# EAGLE schematic The Flying Jalapeno v02 (EAGLE 7.6.0)
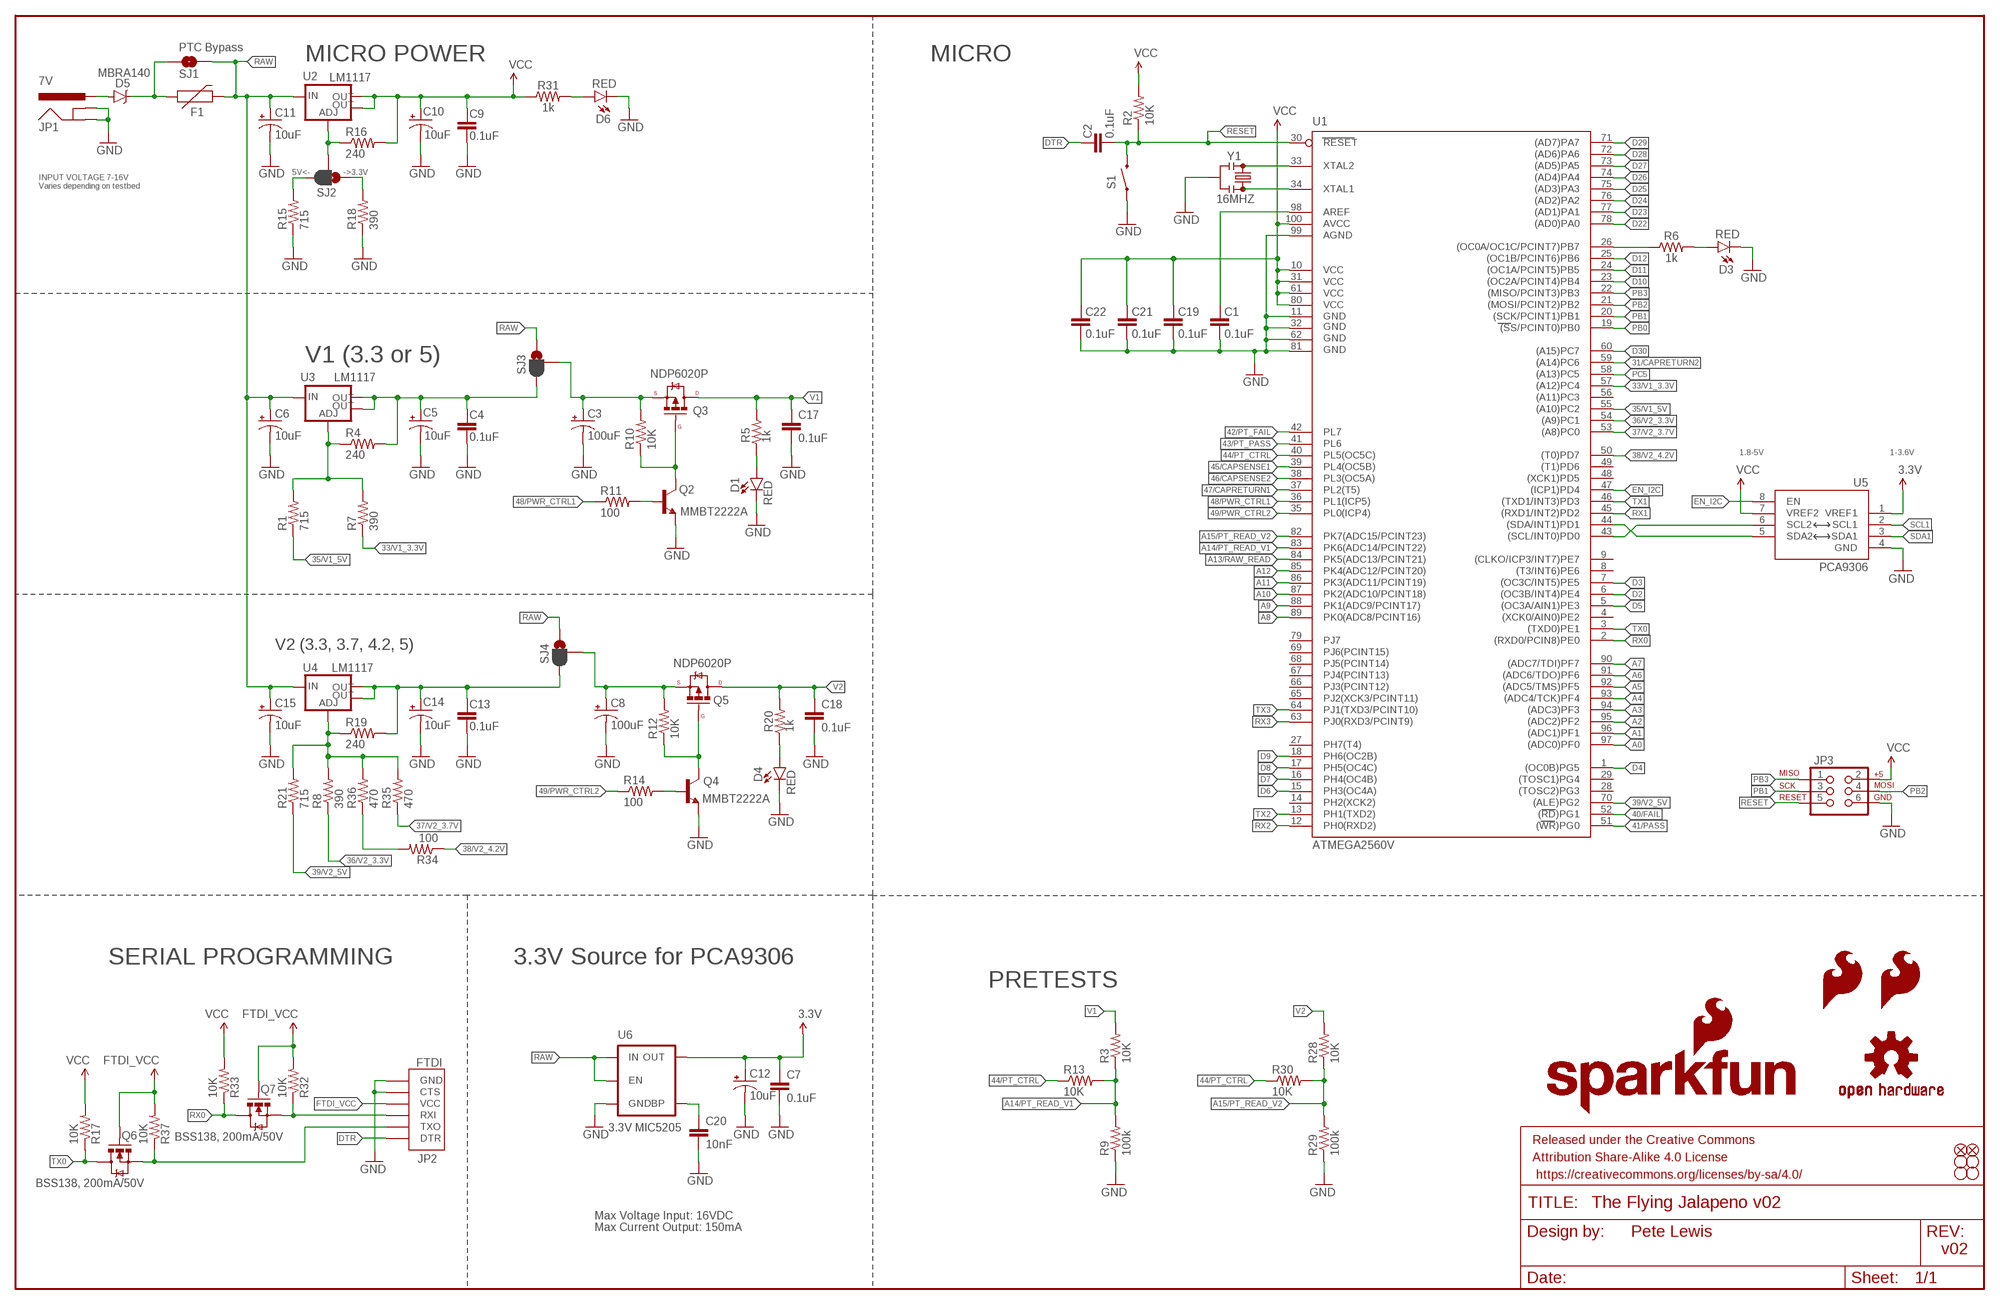
[diagram p0: schematic, sheet 1, part 1 of 2]
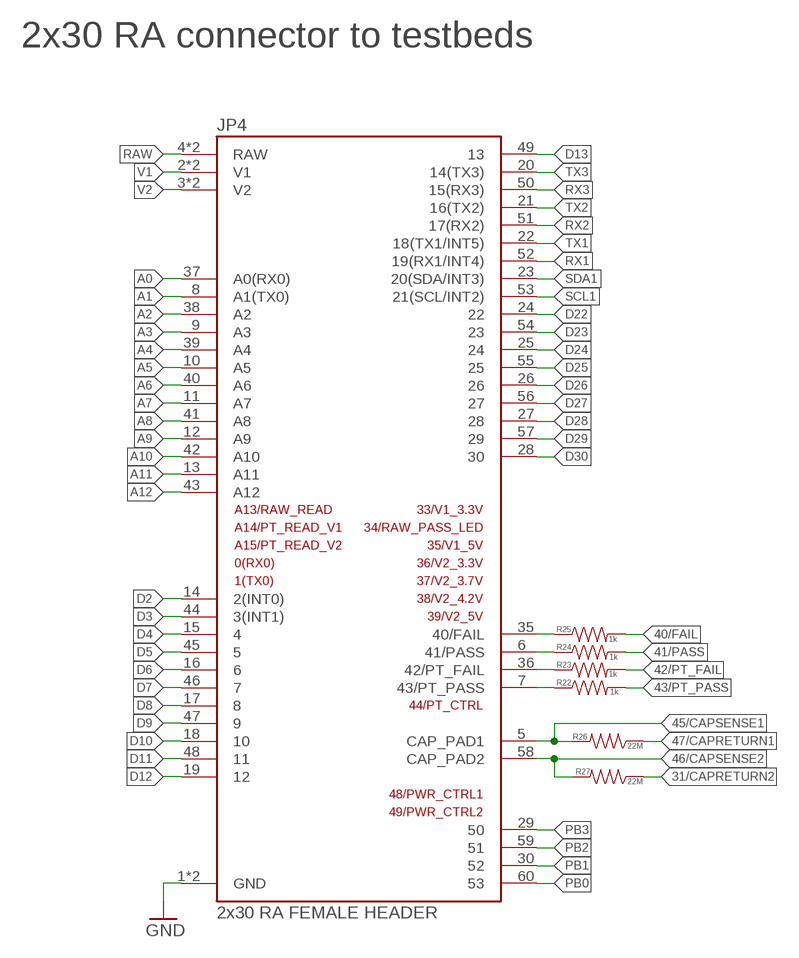
[diagram p1: schematic, sheet 1, part 2 of 2]

## Parts
C1  0.1uF  0.1UF-25V(+80/-20%)(0603)  [0603-CAP]
C2  0.1uF  0.1UF-25V(+80/-20%)(0603)  [0603-CAP]
C3  100uF  100UF-63V-20%(ELECT)  [NIC_10X10.5_CAP]
C4  0.1uF  0.1UF-25V(+80/-20%)(0603)  [0603-CAP]
C5  10uF  10UF-16V-10%(TANT)  [EIA3216]
C6  10uF  10UF-16V-10%(TANT)  [EIA3216]
C7  0.1uF  0.1UF-25V(+80/-20%)(0603)  [0603-CAP]
C8  100uF  100UF-63V-20%(ELECT)  [NIC_10X10.5_CAP]
C9  0.1uF  0.1UF-25V(+80/-20%)(0603)  [0603-CAP]
C10  10uF  10UF-16V-10%(TANT)  [EIA3216]
C11  10uF  10UF-16V-10%(TANT)  [EIA3216]
C12  10uF  10UF-6.3V-20%(0603)(TANT)"  [0603-POL]
C13  0.1uF  0.1UF-25V(+80/-20%)(0603)  [0603-CAP]
C14  10uF  10UF-16V-10%(TANT)  [EIA3216]
C15  10uF  10UF-16V-10%(TANT)  [EIA3216]
C17  0.1uF  0.1UF-25V(+80/-20%)(0603)  [0603-CAP]
C18  0.1uF  0.1UF-25V(+80/-20%)(0603)  [0603-CAP]
C19  0.1uF  0.1UF-25V(+80/-20%)(0603)  [0603-CAP]
C20  10nF  10NF-0603-50V-10%  [0603]
C21  0.1uF  0.1UF-25V(+80/-20%)(0603)  [0603-CAP]
C22  0.1uF  0.1UF-25V(+80/-20%)(0603)  [0603-CAP]
D1  RED  LED-RED1206  [LED-1206]
D3  RED  LED-RED1206  [LED-1206]
D4  RED  LED-RED1206  [LED-1206]
D5  MBRA140  DIODE-SCHOTTKY-MBRA140  [SMA-DIODE]
D6  RED  LED-RED1206  [LED-1206]
F1  PTCTHERMISTOR1206  [PTC-1206]
FRAME1  FRAME-LEDGER  [CREATIVE_COMMONS]
JP1  7V  POWER_JACKPTH_LOCK  [POWER_JACK_PTH_LOCK]
JP2  FTDI  FTDI_BASIC_DEVICE_SIDERA_SMT  [FTDI_DEVICE_RA_SMT]
JP3  AVR_SPI_PRG_6PTH  [2X3]
JP4  2x30 RA FEMALE HEADER  FLYING_JALAPENO_V2FEMALE  [FLYING_JALAPENO_V2_F]
JP5  FIDUCIALUFIDUCIAL  [MICRO-FIDUCIAL]
JP8  FIDUCIALUFIDUCIAL  [MICRO-FIDUCIAL]
LOGO1  SFE_LOGO_NAME_FLAME.5_INCH  [SFE_LOGO_NAME_FLAME_.5]
LOGO2  SFE_LOGO_FLAME.3_INCH  [SFE_LOGO_FLAME_.3]
LOGO3  SFE_LOGO_FLAME.1_INCH  [SFE_LOGO_FLAME_.1]
LOGO4  OSHW-LOGOL  [OSHW-LOGO-L]
Q2  MMBT2222A  TRANSISTOR_NPNMMBT2222A  [SOT23-3]
Q3  NDP6020P  MOSFET-PCHANNELNDP6020P_20V_24A_LOW_VGS_TH  [TO220V]
Q4  MMBT2222A  TRANSISTOR_NPNMMBT2222A  [SOT23-3]
Q5  NDP6020P  MOSFET-PCHANNELNDP6020P_20V_24A_LOW_VGS_TH  [TO220V]
Q6  BSS138, 200mA/50V  MOSFET-NCHANNELBSS138  [SOT23-3]
Q7  BSS138, 200mA/50V  MOSFET-NCHANNELBSS138  [SOT23-3]
R1  715  715OHM1/10W1%(0603)  [0603-RES]
R2  10K  10KOHM-1/10W-1%(0603)0603  [0603-RES]
R3  10K  10KOHM-1/10W-1%(0603)0603  [0603-RES]
R4  240  240OHM1/10W1%(0603)  [0603-RES]
R5  1k  1KOHM-0603-1/10W-1%  [0603]
R6  1k  1KOHM-0603-1/10W-1%  [0603]
R7  390  390OHM1/10W1%(0603)  [0603-RES]
R8  390  390OHM1/10W1%(0603)  [0603-RES]
R9  100k  100KOHM-1/10W-1%(0603)  [0603-RES]
R10  10K  10KOHM-1/10W-1%(0603)0603  [0603-RES]
R11  100  100OHM-1/10W-1%(0603)  [0603-RES]
R12  10K  10KOHM-1/10W-1%(0603)0603  [0603-RES]
R13  10K  10KOHM-1/10W-1%(0603)0603  [0603-RES]
R14  100  100OHM-1/10W-1%(0603)  [0603-RES]
R15  715  715OHM1/10W1%(0603)  [0603-RES]
R16  240  240OHM1/10W1%(0603)  [0603-RES]
R17  10K  10KOHM-1/10W-1%(0603)0603  [0603-RES]
R18  390  390OHM1/10W1%(0603)  [0603-RES]
R19  240  240OHM1/10W1%(0603)  [0603-RES]
R20  1k  1KOHM-0603-1/10W-1%  [0603]
R21  715  715OHM1/10W1%(0603)  [0603-RES]
R22  1k  1KOHM-0603-1/10W-1%  [0603]
R23  1k  1KOHM-0603-1/10W-1%  [0603]
R24  1k  1KOHM-0603-1/10W-1%  [0603]
R25  1k  1KOHM-0603-1/10W-1%  [0603]
R26  22M  22MOHM-1/10W-10%(0603)  [0603-RES]
R27  22M  22MOHM-1/10W-10%(0603)  [0603-RES]
R28  10K  10KOHM-1/10W-1%(0603)0603  [0603-RES]
R29  100k  100KOHM-1/10W-1%(0603)  [0603-RES]
R30  10K  10KOHM-1/10W-1%(0603)0603  [0603-RES]
R31  1k  1KOHM-0603-1/10W-1%  [0603]
R32  10K  10KOHM-1/10W-1%(0603)0603  [0603-RES]
R33  10K  10KOHM-1/10W-1%(0603)0603  [0603-RES]
R34  100  100OHM-1/10W-1%(0603)  [0603-RES]
R35  470  470OHM1/10W1%(0603)  [0603-RES]
R36  470  470OHM1/10W1%(0603)  [0603-RES]
R37  10K  10KOHM-1/10W-1%(0603)0603  [0603-RES]
S1  SWITCH-MOMENTARY-2SMD-REDUNDANT  [TACTILE-SWITCH-SMD]
SJ1  PTC Bypass  JUMPER-PAD-2-NO  [PAD-JUMPER-2-NO_NO_SILK]
SJ2  JUMPER-PAD-3-2OF3_NC_BY_PASTE  [PAD-JUMPER-3-2OF3_NC_BY_PASTE_YES_SILK_FULL_BOX]
SJ3  JUMPER-PAD-3-2OF3_NC_BY_PASTE  [PAD-JUMPER-3-2OF3_NC_BY_PASTE_YES_SILK_FULL_BOX]
SJ4  JUMPER-PAD-3-2OF3_NC_BY_PASTE  [PAD-JUMPER-3-2OF3_NC_BY_PASTE_YES_SILK_FULL_BOX]
STANDOFF1  STAND-OFFTIGHT  [STAND-OFF-TIGHT]
STANDOFF2  STAND-OFFTIGHT  [STAND-OFF-TIGHT]
STANDOFF3  STAND-OFFTIGHT  [STAND-OFF-TIGHT]
STANDOFF4  STAND-OFFTIGHT  [STAND-OFF-TIGHT]
U1  ATMEGA2560AU  [TQFP100]
U2  LM1117  V_REG_LM1117SOT223  [SOT223]
U3  LM1117  V_REG_LM1117SOT223  [SOT223]
U4  LM1117  V_REG_LM1117SOT223  [SOT223]
U5  PCA9306  PCA9306PCA9306DC-1:1  [PCA9306DC-1:1]
U6  3.3V MIC5205  MIC52053.3V  [SOT23-5]
Y1  16MHZ  RESONATOR16MHZ  [RESONATOR-SMD]

## Nets
3.3V: C7.1 C12.A(+) U5.1(VREF1) U6.5(OUT)
31/CAPRETURN2: R27.1 U1.59((A14)PC6)
33/V1_3.3V: R7.1 U1.57((A12)PC4)
35/V1_5V: R1.1 U1.55((A10)PC2)
36/V2_3.3V: R8.1 U1.54((A9)PC1)
37/V2_3.7V: R35.1 U1.53((A8)PC0)
38/V2_4.2V: R34.1 U1.50((T0)PD7)
39/V2_5V: R21.1 U1.70((ALE)PG2)
40/FAIL: R25.2 U1.52((RD)PG1)
41/PASS: R24.2 U1.51((WR)PG0)
42/PT_FAIL: R23.2 U1.42(PL7)
43/PT_PASS: R22.2 U1.41(PL6)
44/PT_CTRL: R13.1 R30.1 U1.40(PL5(OC5C))
45/CAPSENSE1: JP4.5(CAP_PAD1) R26.2 U1.39(PL4(OC5B))
46/CAPSENSE2: JP4.58(CAP_PAD2) R27.2 U1.38(PL3(OC5A))
47/CAPRETURN1: R26.1 U1.37(PL2(T5))
48/PWR_CTRL1: R11.1 U1.36(PL1(ICP5))
49/PWR_CTRL2: R14.1 U1.35(PL0(ICP4))
A0: JP4.37(A0(RX0)) U1.97((ADC0)PF0)
A1: JP4.8(A1(TX0)) U1.96((ADC1)PF1)
A2: JP4.38(A2) U1.95((ADC2)PF2)
A3: JP4.9(A3) U1.94((ADC3)PF3)
A4: JP4.39(A4) U1.93((ADC4/TCK)PF4)
A5: JP4.10(A5) U1.92((ADC5/TMS)PF5)
A6: JP4.40(A6) U1.91((ADC6/TDO)PF6)
A7: JP4.11(A7) U1.90((ADC7/TDI)PF7)
A8: JP4.41(A8) U1.89(PK0(ADC8/PCINT16))
A9: JP4.12(A9) U1.88(PK1(ADC9/PCINT17))
A10: JP4.42(A10) U1.87(PK2(ADC10/PCINT18))
A11: JP4.13(A11) U1.86(PK3(ADC11/PCINT19))
A12: JP4.43(A12) U1.85(PK4(ADC12/PCINT20))
A13/RAW_READ: U1.84(PK5(ADC13/PCINT21))
A14/PT_READ_V1: R3.1 R9.2 R13.2 U1.83(PK6(ADC14/PCINT22))
A15/PT_READ_V2: R28.1 R29.2 R30.2 U1.82(PK7(ADC15/PCINT23))
AREF: C1.2 U1.98(AREF)
D2: JP4.14(2(INT0)) U1.6((OC3B/INT4)PE4)
D3: JP4.44(3(INT1)) U1.7((OC3C/INT5)PE5)
D4: JP4.15 U1.1((OC0B)PG5)
D5: JP4.45 U1.5((OC3A/AIN1)PE3)
D6: JP4.16 U1.15(PH3(OC4A))
D7: JP4.46 U1.16(PH4(OC4B))
D8: JP4.17 U1.17(PH5(OC4C))
D9: JP4.47 U1.18(PH6(OC2B))
D10: JP4.18 U1.23((OC2A/PCINT4)PB4)
D11: JP4.48 U1.24((OC1A/PCINT5)PB5)
D12: JP4.19 U1.25((OC1B/PCINT6)PB6)
D13: JP4.49 R6.1 U1.26((OC0A/OC1C/PCINT7)PB7)
D22: JP4.24 U1.78((AD0)PA0)
D23: JP4.54 U1.77((AD1)PA1)
D24: JP4.25 U1.76((AD2)PA2)
D25: JP4.55 U1.75((AD3)PA3)
D26: JP4.26 U1.74((AD4)PA4)
D27: JP4.56 U1.73((AD5)PA5)
D28: JP4.27 U1.72((AD6)PA6)
D29: JP4.57 U1.71((AD7)PA7)
D30: JP4.28 U1.60((A15)PC7)
DTR: C2.2 JP2.1(DTR)
EN_I2C: U1.47((ICP1)PD4) U5.8(EN)
FTDI_VCC: JP2.4(VCC) Q6.1(G) Q7.1(G) R32.2 R37.2
GND: C1.1 C3.- C4.2 C5.C(-) C6.C(-) C7.2 C8.- C9.2 C10.C(-) C11.C(-) C12.K(-) C13.2 C14.C(-) C15.C(-) C17.2 C18.2 C19.1 C20.2 C21.1 C22.1 D1.C D3.C D4.C D6.C JP1.GND JP1.GNDBREAK JP2.5(CTS) JP2.6(GND) JP3.6 JP4.1(GND) JP4.31(GND) Q2.2(E) Q4.2(E) R9.1 R15.1 R18.1 R29.1 S1.1 S1.2 U1.11(GND) U1.32(GND1) U1.62(GND2) U1.81(GND3) U1.99(AGND) U5.4(GND) U6.2(GND) Y1.2
N$1: R34.2 R36.1
N$2: U1.44((SDA/INT1)PD1) U5.5(SDA2)
N$3: R16.1 SJ2.2 U2.1(ADJ)
N$4: D3.A R6.2
N$5: D1.A R5.1
N$6: JP4.7(43/PT_PASS) R22.1
N$7: JP4.36(42/PT_FAIL) R23.1
N$8: Q2.1(B) R11.2
N$9: R1.2 R4.1 R7.2 U3.1(ADJ)
N$10: R8.2 R19.1 R21.2 R35.2 R36.2 U4.1(ADJ)
N$11: D4.A R20.1
N$12: Q2.3(C) Q3.1(G) R10.1
N$13: Q4.1(B) R14.2
N$14: Q4.3(C) Q5.1(G) R12.1
N$15: D5.C F1.1 SJ1.1
N$16: JP2.3(RXI) Q7.2(S) R32.1
N$17: R18.2 SJ2.1
N$18: R15.2 SJ2.3
N$19: JP4.6(41/PASS) R24.1
N$20: JP4.35(40/FAIL) R25.1
N$21: C4.1 C5.A(+) R4.2 SJ3.3 U3.2(OUT) U3.4(OUT)
N$22: C3.+ Q3.3(S) R10.2 SJ3.2
N$23: C8.+ Q5.3(S) R12.2 SJ4.2
N$24: D5.A JP1.PWR
N$25: D6.A R31.2
N$26: JP2.2(TXO) Q6.2(S) R37.1
N$27: U1.43((SCL/INT0)PD0) U5.6(SCL2)
N$28: C20.1 U6.4(BP)
N$73: U1.33(XTAL2) Y1.3
N$74: U1.34(XTAL1) Y1.1
PB0: JP4.60 U1.19((SS/PCINT0)PB0)
PB1: JP3.3 JP4.30 U1.20((SCK/PCINT1)PB1)
PB2: JP3.4 JP4.59 U1.21((MOSI/PCINT2)PB2)
PB3: JP3.1 JP4.29 U1.22((MISO/PCINT3)PB3)
PC5: U1.58((A13)PC5)
RAW [BIG]: C6.A(+) C11.A(+) C15.A(+) F1.2 JP4.4(RAW) JP4.34(RAW) SJ1.2 SJ3.1 SJ4.1 U2.3(IN) U3.3(IN) U4.3(IN) U6.1(IN) U6.3(EN)
RESET: C2.1 JP3.5 R2.1 S1.3 S1.4 U1.30(RESET)
RX0: Q7.3(D) R33.1 U1.2((RXD0/PCIN8)PE0)
RX1: JP4.52(19(RX1/INT4)) U1.45((RXD1/INT2)PD2)
RX2: JP4.51(17(RX2)) U1.12(PH0(RXD2))
RX3: JP4.50(15(RX3)) U1.63(PJ0(RXD3/PCINT9))
SCL1: JP4.53(21(SCL/INT2)) U5.2(SCL1)
SDA1: JP4.23(20(SDA/INT3)) U5.3(SDA1)
TX0: Q6.3(D) R17.1 U1.3((TXD0)PE1)
TX1: JP4.22(18(TX1/INT5)) U1.46((TXD1/INT3)PD3)
TX2: JP4.21(16(TX2)) U1.13(PH1(TXD2))
TX3: JP4.20(14(TX3)) U1.64(PJ1(TXD3/PCINT10))
V1 [BIG]: C17.1 JP4.2(V1) JP4.32(V1) Q3.2(D) R3.2 R5.2
V2: C18.1 JP4.3(V2) JP4.33(V2) Q5.2(D) R20.2 R28.2
VCC [POWER]: C9.1 C10.A(+) C19.2 C21.2 C22.2 JP3.2 R2.2 R16.2 R17.2 R31.1 R33.2 U1.10(VCC) U1.31(VCC1) U1.61(VCC2) U1.80(VCC3) U1.100(AVCC) U2.2(OUT) U2.4(OUT) U5.7(VREF2)
VREG2OUT: C13.1 C14.A(+) R19.2 SJ4.3 U4.2(OUT) U4.4(OUT)
Unconnected: U1.4((XCK0/AIN0)PE2) U1.8((T3/INT6)PE6) U1.9((CLKO/ICP3/INT7)PE7) U1.14(PH2(XCK2)) U1.27(PH7(T4)) U1.28((TOSC2)PG3) U1.29((TOSC1)PG4) U1.48((XCK1)PD5) U1.49((T1)PD6) U1.56((A11)PC3) U1.65(PJ2(XCK3/PCINT11)) U1.66(PJ3(PCINT12)) U1.67(PJ4(PCINT13)) U1.68(PJ5(PCINT14)) U1.69(PJ6(PCINT15)) U1.79(PJ7)

## Notes on the sheet
- MICRO POWER | MICRO
- 2x30 RA connector to testbeds
- 5V<- | ->3.3V
- INPUT VOLTAGE 7-16V
  Varies depending on testbed
- V1 (3.3 or 5)
- S | D
- G
- 1.8-5V | 1-3.6V
- V2 (3.3, 3.7, 4.2, 5)
- S | D
- G
- ATMEGA2560V
- SERIAL PROGRAMMING | 3.3V Source for PCA9306
- PRETESTS
- Max Voltage Input: 16VDC
- Max Current Output: 150mA
- Pete Lewis
- v02

## Library data of the parts
C1 C2 C4 C7 C9 C13 C17-C19 C21 C22 = SparkFun-Capacitors:0.1UF-25V(+80/-20%)(0603): CAP-00810 Ceramic Standard decoupling cap; PROD_ID: CAP-00810
C3 C8 = SparkFun-Capacitors:100UF-63V-20%(ELECT): CAP-08362 100uF electrolytic SMT 63V 20%; PROD_ID: CAP-08362
C5 C6 C10 C11 C14 C15 = SparkFun-Capacitors:10UF-16V-10%(TANT): CAP-00811 1206/EIA-3216 Tantalum capacitor; PROD_ID: CAP-00811
C12 = SparkFun-Capacitors:10UF-6.3V-20%(0603)(TANT); PROD_ID: CAP-13210
C20 = SparkFun-Capacitors:10NF: 0.01uF/10nF/10,000pF ceramic capacitors A capacitor is a passive two-terminal electrical component used to store electrical energy temporarily in an electric field. CAP-09321; PROD_ID: CAP-00867
D1 D3 D4 D6 = SparkFun-LED:LED-RED: Assorted Red LEDs LilyPad 1206- DIO-09912 1206- DIO-00809 0603- DIO-00819 "SMART" means more efficient and expensive; PROD_ID: DIO-00809
D5 = SparkFun-DiscreteSemi:DIODE-SCHOTTKY: Schottky diodes in SFE's production catalog BAT20J 1A 23V 0.62Vf RB751 120mA 40V 0.37Vf PMEG4005EJ 0.5A 40V 0.42Vf MBRA140 1A 40V 0.5Vf B340A 3A 40V SMA; PROD_ID: DIO-08053
F1 = SparkFun-PowerIC:PTC: Resettable Fuse PTC Resettable Fuse. Spark Fun Electronics SKU : COM-08357; PROD_ID: RES-08585
FRAME1 = SparkFun-Aesthetics:FRAME-LEDGER: Schematic Frame Standard 11x14 US Ledger frame
JP1 = SparkFun-Connectors:POWER_JACK: Power Jack This is the standard 5.5mm barrel jack for power. The PTH is the most common, proven, reliable, footprint. The Slot footprint only works if the mill layer is transmitted to the PCB fab house so be warned. Mating wall wart : TOL-00298 (and others); PROD_ID: CONN-08197; SF_ID: PRT-00119
JP2 = SparkFun-Connectors:FTDI_BASIC_DEVICE_SIDE: Connector which mates to FTDI basic or FTDI cable.; PROD_ID: CONN-08971
JP3 = SparkFun:AVR_SPI_PRG_6: AVR ISP 6 Pin This is the reduced ISP connector for AVR programming. Common on Arduino. This footprint will take up less PCB space and can be used with a 10-pin to 6-pin adapter such as SKU: BOB-08508
JP4 = Testing:FLYING_JALAPENO_V2; PROD_ID: CONN-13106
JP5 JP8 = SparkFun:FIDUCIAL: Fiducial Alignment Points Various fiducial points for machine vision alignment.
LOGO1 = SparkFun-Aesthetics:SFE_LOGO_NAME_FLAME: SFE Logo, name and flame This is the SparkFun full logo. The logo on the schematic will always be the same size; the package variant is the height of the flame part of the logo. Default layer for the logo on the board is tSilk.
LOGO2 LOGO3 = SparkFun-Aesthetics:SFE_LOGO_FLAME: SFE Logo, flame only This is the SparkFun flame logo. The logo on the schematic will always be the same size; the package variant is the height of the flame. Default layer for the logo on the board is tSilk.
LOGO4 = SparkFun-Aesthetics:OSHW-LOGO: Open Source Hardware Logo This logo indicates the piece of hardware it is found on incorporates a OSHW license and/or adheres to the definition of open source hardware found here: http://freedomdefined.org/OSHW
Q2 Q4 = SparkFun-DiscreteSemi:TRANSISTOR_NPN: Generic NPN BJT MMBT2222A - TRANS-08049 (SOT-23, 1A 40V) MPSA42 - TRANS-09116 (SOT-23, 500mA 300V) MMBT5088LT1G - TRANS-11160 (SOT-23, 50 mA 30V) BC547 - COM-08928 <http://www.sparkfun.com/products/8928> (TO-92 45V 100mA) (1.Collector 2.Base 3.Emitter) 2N3904 - COM-00521 <http://www.sparkfun.com/products/521> (TO-92 40V 200mA) (1.Emitter 2.Base 3.Collector) P2N2222A - COM-12852 <http://www.sparkfun.com/products/12852> (TO-92 40V 600mA) (1.Collector 2.Base 3.Emitter); PROD_ID: TRANS-08049
Q3 Q5 = SparkFun-DiscreteSemi:MOSFET-PCHANNEL: Generic PMOSFET IRLML2244 - TRANS-11153 (SOT-23 -20V -4.3A) (1.Gate 2.Source 3.Drain) FQP27P06 - COM-10349 <http://www.sparkfun.com/products/10349> (TO-220 -60V -27A) (1.Gate 2.Source 3.Drain); PROD_ID: TRANS-13060
Q6 Q7 = SparkFun-DiscreteSemi:MOSFET-NCHANNEL: Common NMOSFET Parts MFG P/N Store ID Prod ID FDD8780 TRANS-09984 SI7820DN TRANS-11055 FDS6630A IC-08089 2N7002PW TRANS-11151 FQP30N06L COM-10213 TRANS-10060 BSS123LT1G TRANS-08345 BSS138 TRANS-00830 BS170 2N7000; PROD_ID: TRANS-00830; VALUE: 200mA/50V
R1 R15 R21 = SparkFun-Resistors:715OHM1/10W1%(0603): RES-07850; PROD_ID: RES-07850
R2 R3 R10 R12 R13 R17 R28 R30 R32 R33 R37 = SparkFun-Resistors:10KOHM-1/10W-1%(0603): RES-00824; PROD_ID: RES-00824
R4 R16 R19 = SparkFun-Resistors:240OHM1/10W1%(0603): RES-07849; PROD_ID: RES-07849
R5 R6 R20 R22-R25 R31 = SparkFun-Resistors:1KOHM: 1kΩ resistor A resistor is a passive two-terminal electrical component that implements electrical resistance as a circuit element. Resistors act to reduce current flow, and, at the same time, act to lower voltage levels within circuits.; PROD_ID: RES-07856
R7 R8 R18 = SparkFun-Resistors:390OHM1/10W1%(0603): RES-07864; PROD_ID: RES-07864
R9 R29 = SparkFun-Resistors:100KOHM-1/10W-1%(0603): RES-07828; PROD_ID: RES-07828
R11 R14 R34 = SparkFun-Resistors:100OHM-1/10W-1%(0603): RES-07863; PROD_ID: RES-07863
R26 R27 = SparkFun-Resistors:22MOHM-1/10W-10%(0603): RES-11132; PROD_ID: RES-11132
R35 R36 = SparkFun-Resistors:470OHM1/10W1%(0603): RES-07869; PROD_ID: RES-07869
S1 = SparkFun-Electromechanical:SWITCH-MOMENTARY-2: Various NO switches- pushbuttons, reed, etc; PROD_ID: SWCH-08247
SJ1 = SparkFun-Passives:JUMPER-PAD-2-NO
SJ2-SJ4 = SparkFun-Passives:JUMPER-PAD-3-2OF3_NC_BY_PASTE
STANDOFF1-STANDOFF4 = SparkFun-Electromechanical:STAND-OFF: #4 Stand Off This is the mechanical footprint for a #4 phillips button head screw. Use the keepout ring to avoid running the screw head into surrounding components. SKU : PRT-00447
U1 = SparkFun-DigitalIC:ATMEGA2560: Atmel 100-pin 8-bit uC 64/128/256 Kbytes FLASH 4 Kbytes EEPROM 8 Kbytes SRAM 86 General Purpose I/O pins 12-channels16-bit PWM 4 x Serial USARTs 16-channels 10-bit A/D; PROD_ID: IC-10040
U2-U4 = SparkFun-PowerIC:V_REG_LM1117: Voltage Regulator LM1117 Standard adjustable voltage regulator but in SMD form. Spark Fun Electronics SKU : COM-00595; PROD_ID: VREG-08170
U5 = SparkFun-DigitalIC:PCA9306: Bidirectional I2C level shifter. NOT compatible with all available part number pinout schemes- DOUBLE CHECK!!!; PROD_ID: IC-10023
U6 = SparkFun-PowerIC:MIC5205: MIC5205 150mA vreg 3.3V - VREG-00822 5V - VREG-00823; PROD_ID: VREG-00822
Y1 = SparkFun-FreqCtrl:RESONATOR: Resonator Small SMD resonator. Used, eg, on the Arduino Pro/ Pro Mini boards. 8MHz- XTAL-08895 16MHz- XTAL-08900; PROD_ID: XTAL-08900

## Net classes
0 default: width 0.203 mm
1 BIG: width 0.203 mm
2 POWER: width 0.203 mm
10 12_mil: width 0.305 mm, drill 0.381 mm
11 15_mil: width 0.381 mm, drill 0.381 mm